# Altium schematic sheet Current_Meas.SchDoc
size A
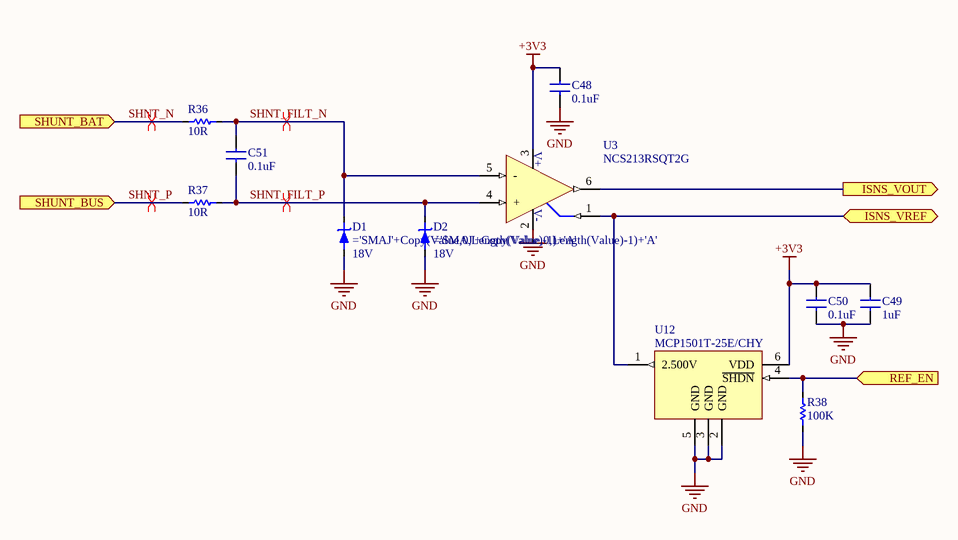
[diagram p0: Current_Meas.SchDoc]

## Parts
C48  value 0.1uF  [0402_CAPACITOR]  (hidden comment: CAP 0.1uF 16V X7R)
C49  value 1uF  [0402_CAPACITOR]  (hidden comment: CAP 1uF 6.3V X5R)
C50  value 0.1uF  [0402_CAPACITOR]  (hidden comment: CAP 0.1uF 16V X7R)
C51  value 0.1uF  [0402_CAPACITOR]  (hidden comment: CAP 0.1uF 16V X7R)
D1  value 18V  [SMA]  (hidden comment: TVS Diode)
D2  value 18V  [SMA]  (hidden comment: TVS Diode)
R36  value 10R  [0402_Resistor]  (hidden comment: R_0402_10R_1%)
R37  value 10R  [0402_Resistor]  (hidden comment: R_0402_10R_1%)
R38  value 100K  [0402_Resistor]  (hidden comment: R_0402_100K_1%)
U3  NCS213RSQT2G  [SC70-6]
U12  MCP1501T-25E/CHY  [SOT23-6]

## Ports
ISNS_VOUT (out), ISNS_VREF (bidir), REF_EN (in), SHUNT_BAT (in), SHUNT_BUS (in)

## Nets
+3V3: C48.1 C49.1 C50.1 U3.3(VCC+) U12.6(VDD)
GND: C48.2 C49.2 C50.2 D1.1(Anode) D2.1(Anode) R38.1 U3.2(VCC-) U12.2(GND) U12.3(GND) U12.5(GND)
ISNS_VOUT: U3.6(OUT) ; port ISNS_VOUT
ISNS_VREF: U3.1(REF) U12.1(2.500V) ; port ISNS_VREF
REF_EN: R38.2 U12.4(~{SHDN}) ; port REF_EN
SHNT_FILT_N: C51.1 D1.2(Cathode) R36.2 U3.5(-)
SHNT_FILT_P: C51.2 D2.2(Cathode) R37.2 U3.4(+)
SHNT_N: R36.1 ; port SHUNT_BAT
SHNT_P: R37.1 ; port SHUNT_BUS

## Layout directives
differential pair: SHNT_FILT_N, SHNT_FILT_P, SHNT_N, SHNT_P

## Notes on the sheet
- (in symbol U_NCS213RSQT2G) V+; V-

## Library data of the parts
C48 C50 C51 = C_0402_0.1uF_16V_10%: CAP CERM 0.1uF 10% 16V 0402; Package: =SelectedPackage; Voltage: 16V; Temperature Coefficient: X7R; Supplier 1: Digi-Key; Supplier Part Number 1: 1276-1001-1-ND; Supplier 2: Digi-Key; Supplier Part Number 2: 587-1451-1-ND
C49 = C_0402_1uF_6.3V_20%: CAP CERM 1uF 20% 6.3V 0402; Package: =SelectedPackage; Voltage: 6.3V; Temperature Coefficient: X5R; Supplier 1: Digi-Key; Supplier Part Number 1: 1276-1235-1-ND
D1 D2 = D_TVS_SMAJ_Uni_generic: SMA Unidirectional TVS Diode; Manufacturer: Vishay; Power - Peak Pulse: 400W; Type: Zener; Operating Temperature: -55°C ~ 150°C; HelpURL: http://www.vishay.com/docs/88392/smbj.pdf; Manufacturer PN: ='SMAJ'+Copy(Value,0,Length(Value)-1)+'A'
R36-R38 = R_0402_generic_1%: Generic 0402 Resistor (10.2R to 10M); Manufacturer: Yageo; Power Rating: 0.0625W; Temperature Coefficient: ±100ppm/°C; Tolerance: ±1%; Voltage Rating: 50V; Operating Temperature: -55°C ~ 155°C; Manufacturer Part Number: ='RC0402FR-07'+ValueFormatted+'L'; HelpURL: https://www.digikey.com/products/en/resistors/chip-resistor-surface-mount/52?pv17=103&FV=fffc000d%2Cc0001%2C1c0002%2C1f140000%2Cffe00034&k=RC0402; ValueFormatted: =Copy(Copy(Value, 0, Pos('.', Value)-1)+Copy(Value, Length(Value), 1)+Copy(Value, Pos('.', Value)+1, Length(Value)-Pos('.', Value)-1),1,Pos('.',Value)*Length(Value))+Copy(Value,1,Length(Value)*(1-Pos('.',Value)))
U3 = U_NCS213RSQT2G: Current Sense Amplifier 1 Circuit Rail-to-Rail SC-88/SC70-6/SOT-363, Gain=50; Manufacturer: ON Semiconductor; Gain: 50; Supplier 1: Digi-Key; Supplier Part Number 1: NCS213RSQT2GOSDKR-ND; Manufacturer Part Number: NCS213RSQT2G
U12 = U_MCP1501T-25E/CHY: Series Voltage Reference IC ±0.1% 20mA SOT-23-6; Manufacturer: Microchip; Output Type: Fixed; Operating Supply Current: 550uA; Min Output Voltage: 2.5V; Tolerance: 0.1%; Output Current: 20mA; Max Operating Temperature: 125°C; Manufacturer Part Number: MCP1501T-25E/CHY; Min Operating Temperature: -40°C; Reference Type: Series; Supplier 1: Digi-Key; Supplier Part Number 1: MCP1501T-25E/CHYCT-ND